# EAGLE design DualLEDPanel v1 (EAGLE 6.4)
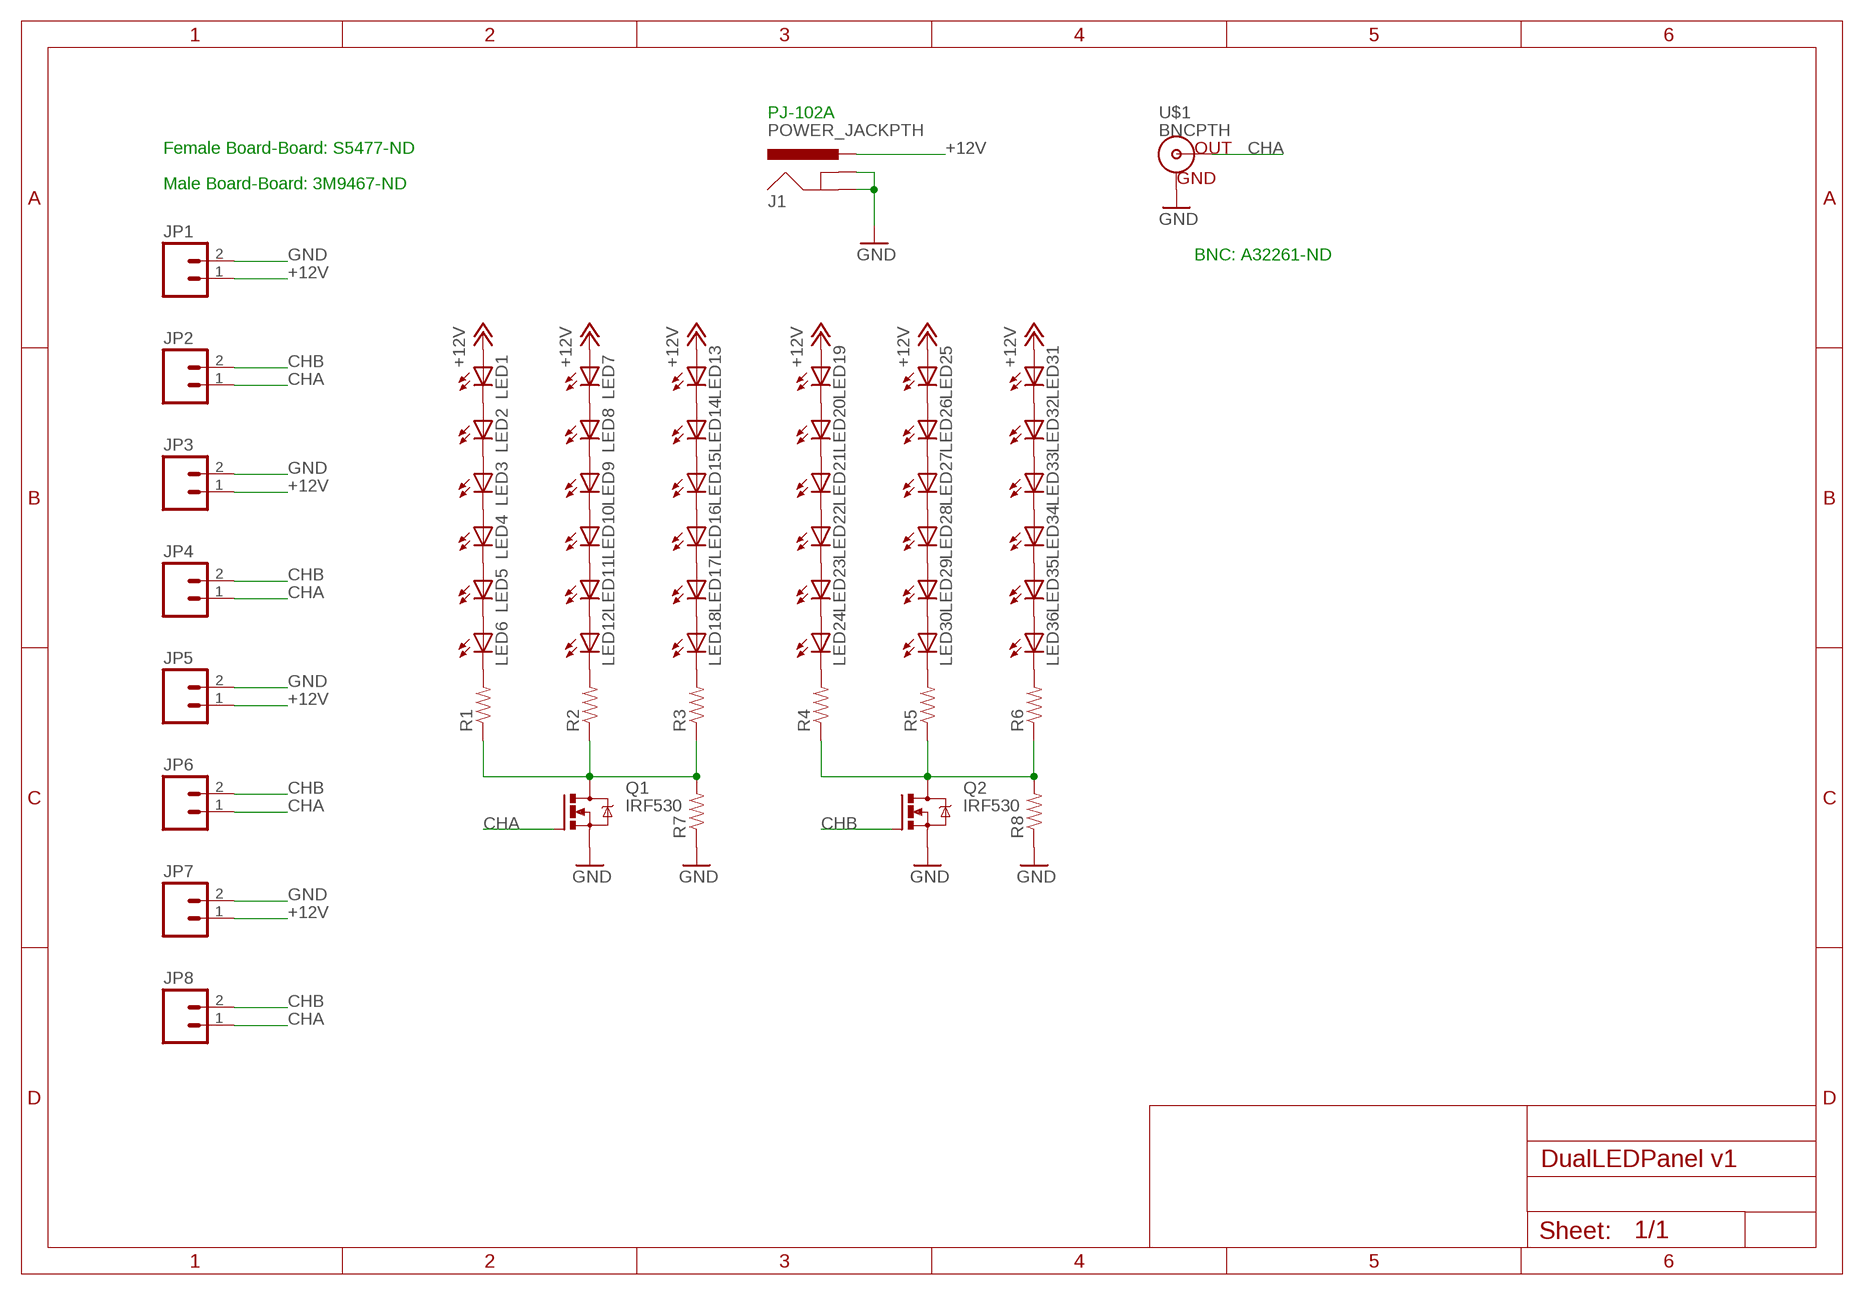
[diagram p0: schematic, sheet 1]

## Parts
J1  POWER_JACKPTH  [POWER_JACK_PTH]
JP1  M02PTH  [1X02]
JP2  M02PTH  [1X02]
JP3  M02PTH  [1X02]
JP4  M02PTH  [1X02]
JP5  M02PTH  [1X02]
JP6  M02PTH  [1X02]
JP7  M02PTH  [1X02]
JP8  M02PTH  [1X02]
LED1  LED5MM  [LED5MM]
LED2  LED5MM  [LED5MM]
LED3  LED5MM  [LED5MM]
LED4  LED5MM  [LED5MM]
LED5  LED5MM  [LED5MM]
LED6  LED5MM  [LED5MM]
LED7  LED5MM  [LED5MM]
LED8  LED5MM  [LED5MM]
LED9  LED5MM  [LED5MM]
LED10  LED5MM  [LED5MM]
LED11  LED5MM  [LED5MM]
LED12  LED5MM  [LED5MM]
LED13  LED5MM  [LED5MM]
LED14  LED5MM  [LED5MM]
LED15  LED5MM  [LED5MM]
LED16  LED5MM  [LED5MM]
LED17  LED5MM  [LED5MM]
LED18  LED5MM  [LED5MM]
LED19  LED5MM  [LED5MM]
LED20  LED5MM  [LED5MM]
LED21  LED5MM  [LED5MM]
LED22  LED5MM  [LED5MM]
LED23  LED5MM  [LED5MM]
LED24  LED5MM  [LED5MM]
LED25  LED5MM  [LED5MM]
LED26  LED5MM  [LED5MM]
LED27  LED5MM  [LED5MM]
LED28  LED5MM  [LED5MM]
LED29  LED5MM  [LED5MM]
LED30  LED5MM  [LED5MM]
LED31  LED5MM  [LED5MM]
LED32  LED5MM  [LED5MM]
LED33  LED5MM  [LED5MM]
LED34  LED5MM  [LED5MM]
LED35  LED5MM  [LED5MM]
LED36  LED5MM  [LED5MM]
Q1  IRF530  [TO220BV]
Q2  IRF530  [TO220BV]
R1  RESISTORPTH-1/4W  [AXIAL-0.4]
R2  RESISTORPTH-1/4W  [AXIAL-0.4]
R3  RESISTORPTH-1/4W  [AXIAL-0.4]
R4  RESISTORPTH-1/4W  [AXIAL-0.4]
R5  RESISTORPTH-1/4W  [AXIAL-0.4]
R6  RESISTORPTH-1/4W  [AXIAL-0.4]
R7  RESISTORPTH-1/4W  [AXIAL-0.4]
R8  RESISTORPTH-1/4W  [AXIAL-0.4]
U$1  BNCPTH  [BNC]

## Nets
+12V: J1.PWR JP1.1 JP3.1 JP5.1 JP7.1 LED1.A LED7.A LED13.A LED19.A LED25.A LED31.A
CHA: JP2.1 JP4.1 JP6.1 JP8.1 Q1.G U$1.S(OUT)
CHB: JP2.2 JP4.2 JP6.2 JP8.2 Q2.G
GND: J1.GND J1.GNDBREAK JP1.2 JP3.2 JP5.2 JP7.2 Q1.S Q2.S R7.P$1 R8.P$1 U$1.GND
N$1: LED1.K(C) LED2.A
N$2: LED2.K(C) LED3.A
N$3: LED3.K(C) LED4.A
N$4: LED4.K(C) LED5.A
N$5: LED5.K(C) LED6.A
N$6: LED6.K(C) R1.P$2
N$7: LED7.K(C) LED8.A
N$8: LED8.K(C) LED9.A
N$9: LED9.K(C) LED10.A
N$10: LED10.K(C) LED11.A
N$11: LED11.K(C) LED12.A
N$12: LED12.K(C) R2.P$2
N$13: LED13.K(C) LED14.A
N$14: LED14.K(C) LED15.A
N$15: LED15.K(C) LED16.A
N$16: LED16.K(C) LED17.A
N$17: LED17.K(C) LED18.A
N$18: LED18.K(C) R3.P$2
N$19: LED19.K(C) LED20.A
N$20: LED20.K(C) LED21.A
N$21: Q1.D R1.P$1 R2.P$1 R3.P$1 R7.P$2
N$22: LED21.K(C) LED22.A
N$23: LED22.K(C) LED23.A
N$24: Q2.D R4.P$1 R5.P$1 R6.P$1 R8.P$2
N$25: LED23.K(C) LED24.A
N$26: LED24.K(C) R4.P$2
N$27: LED25.K(C) LED26.A
N$28: LED26.K(C) LED27.A
N$29: LED27.K(C) LED28.A
N$30: LED28.K(C) LED29.A
N$31: LED29.K(C) LED30.A
N$32: LED30.K(C) R5.P$2
N$33: LED31.K(C) LED32.A
N$34: LED32.K(C) LED33.A
N$35: LED33.K(C) LED34.A
N$36: LED34.K(C) LED35.A
N$37: LED35.K(C) LED36.A
N$38: LED36.K(C) R6.P$2

## Notes on the sheet
- PJ-102A
- Female Board-Board: S5477-ND
- Male Board-Board: 3M9467-ND
- BNC: A32261-ND

## Library data of the parts
J1 = SparkFun-Connectors:POWER_JACK: Power Jack This is the standard 5.5mm barrel jack for power. The PTH is the most common, proven, reliable, footprint. The Slot footprint only works if the mill layer is transmitted to the PCB fab house so be warned. Spark Fun Electronics SKU : PRT-00119 SMT: CONN-08106 Mating wall wart : TOL-00298 (and others)
JP1-JP8 = sparkFun:M02: Header 2 Standard 2-pin 0.1" header. Use with straight break away headers (SKU : PRT-00116), right angle break away headers (PRT-00553), swiss pins (PRT-00743), machine pins (PRT-00117), and female headers (PRT-00115). Molex polarized connector foot print use with SKU : PRT-08233 with associated crimp pins and housings.
LED1-LED36 = SparkFun-LED:LED: LEDs Standard schematic elements and footprints for 5mm, 3mm, 1206, and 0603 sized LEDs. 5mm - Spark Fun Electronics SKU : COM-00529 (and others)
Q1 Q2 = transistor-power:IRF530: HEXFET Power MOSFET
R1-R8 = SparkFun-Passives:RESISTOR: Resistor Basic schematic elements and footprints for 0603, 1206, and PTH resistors.
U$1 = SparkFun-Connectors:BNC: BNC Connector, Mouser Part# 5227161

## Net classes
0 default: width 1.27 mm, clearance 0.508 mm

## Board
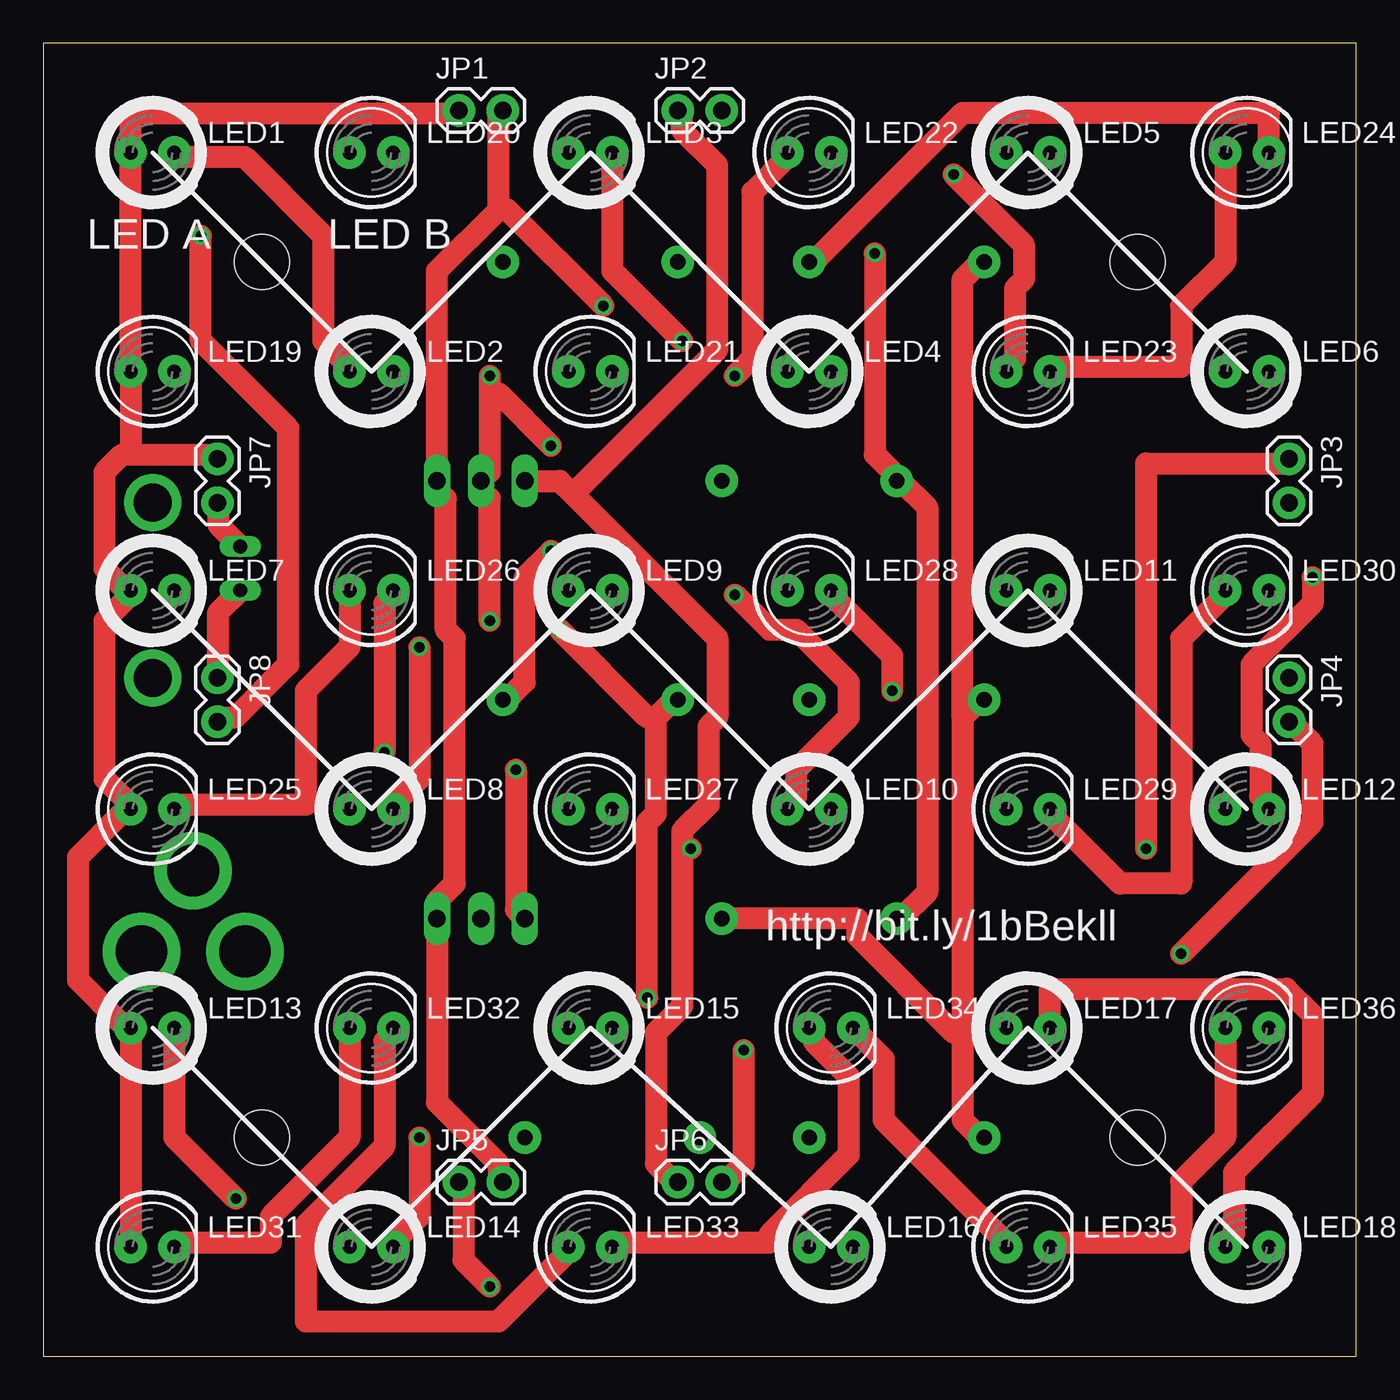
[diagram p1: board, top side]
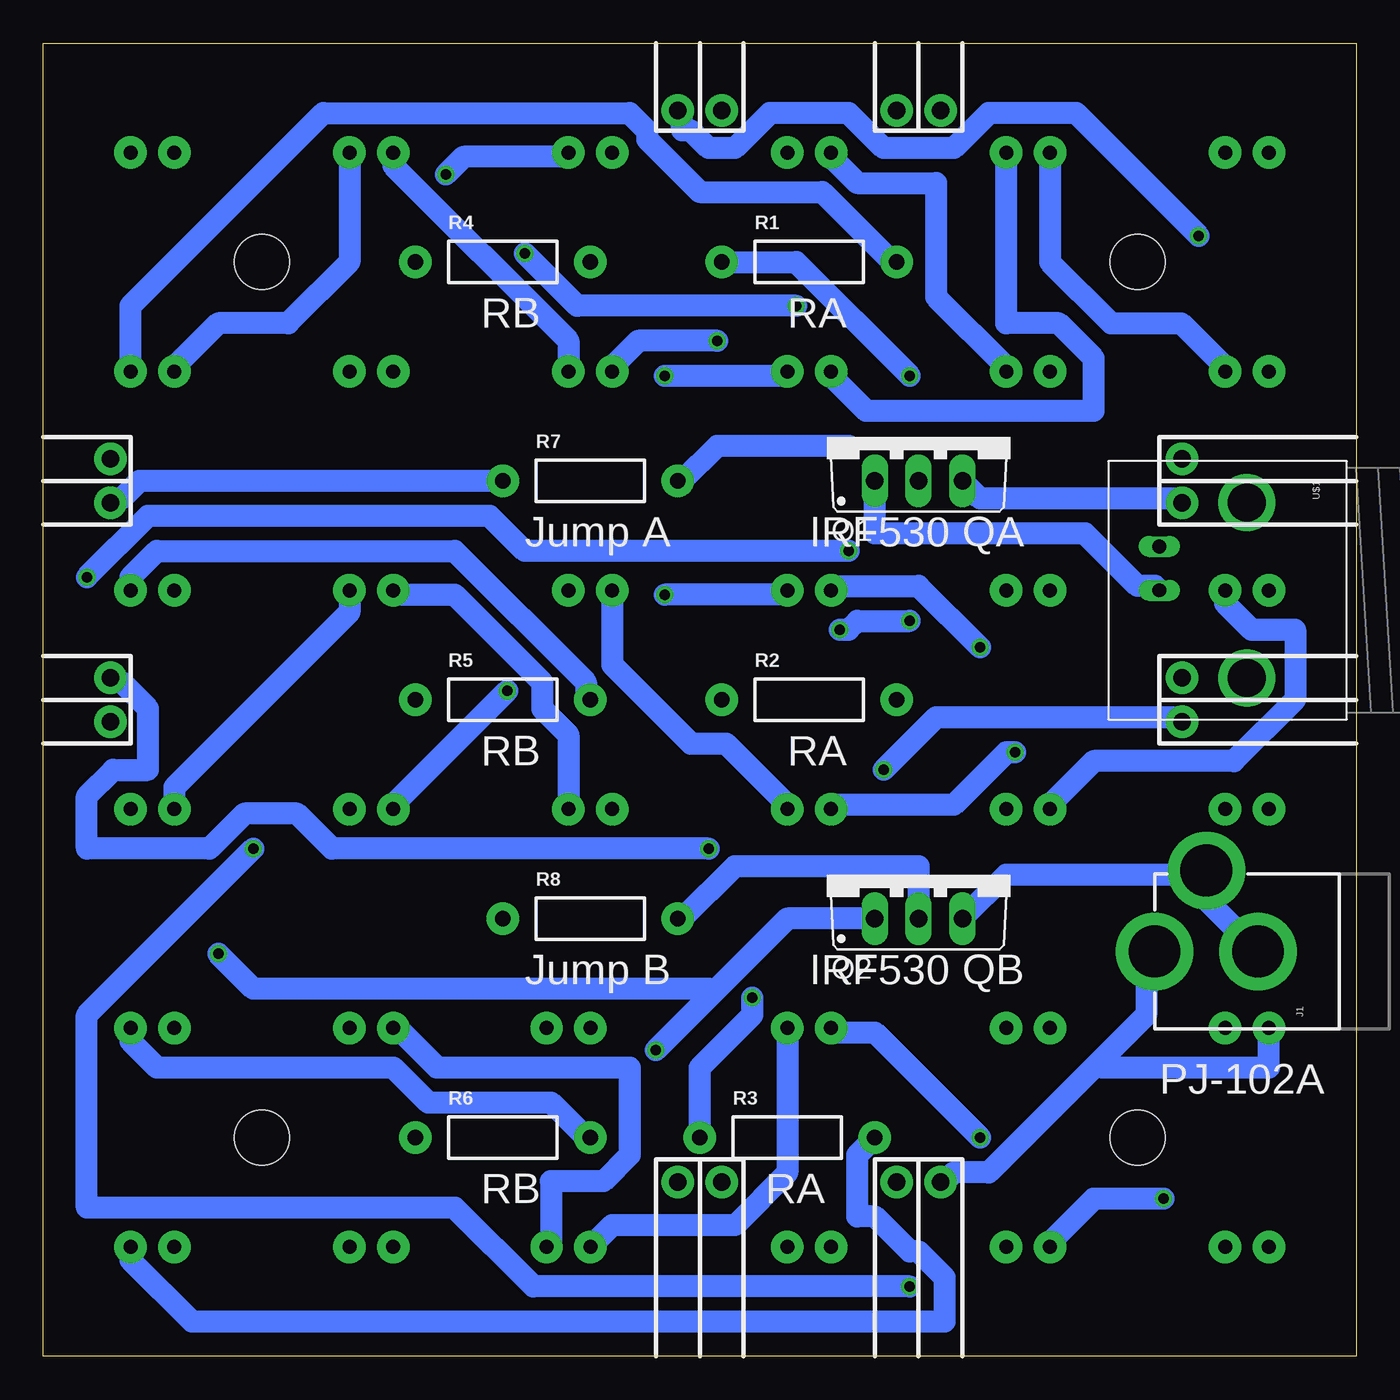
[diagram p2: board, bottom side, seen from below]

Size 76.2 x 76.2 mm. Coordinates in mm from the lower left corner, seen from the top.
Outline: 0,0 76.2,0 76.2,76.2 0,76.2 0,0
Copper layers (1*16): Top 0.0178mm / dielectric 59mil / Bottom 0.0178mm
Design rules "SSC-EAGLE-2Lyr_v1.0.0.3": minimum track width 6mil, minimum drill 14mil, track to track 6mil, track to pad 6mil, pad to pad 6mil, via to via 6mil, smd to smd 6mil, copper to edge 20mil, drill to drill 16mil, minimum pad ring 8mil, minimum via ring 8mil, stop-mask expansion 3mil, vias tented up to drill 0mil, thermal gap 10mil
Holes 3.17 mm at 12.7,12.7 12.7,63.5 63.5,63.5 63.5,12.7

### Footprints (pad centres in the part's own frame; a part is rotated, then mirrored left to right if it is on the bottom)
POWER_JACK_PTH = drill 2.997 pad 4.318: GND 0,7.7; GNDBREAK 4.7,10.7; PWR 0,13.7
1X02 = drill 1.016 pad 1.88: 1 0,0; 2 2.54,0
LED5MM = drill 0.813 pad 1.88: A -1.27,0; K 1.27,0
TO220BV = drill 1.016 long: D 0,-2.54; G -2.54,-2.54; S 2.54,-2.54
AXIAL-0.4 = drill 0.9 pad 1.88: P$1 -5.08,0; P$2 5.08,0
BNC = drill 2.2: 3 -5.08,5.08; 4 5.08,5.08 | drill 0.8 long: GND -2.54,0; S 0,0

### Placement (x,y rotation side)
J1  -1.99,23.5 90 bottom
JP1  24.13,72.29 0 top
JP2  36.83,72.29 0 top
JP3  72.29,52.07 270 top
JP4  72.29,39.37 270 top
JP5  24.13,10.11 0 top
JP6  36.83,10.11 0 top
JP7  10.11,52.07 270 top
JP8  10.11,39.37 270 top
LED1  6.35,69.85 0 top
LED2  19.05,57.15 0 top
LED3  31.75,69.85 0 top
LED4  44.45,57.15 0 top
LED5  57.15,69.85 0 top
LED6  69.85,57.15 0 top
LED7  6.35,44.45 0 top
LED8  19.05,31.75 0 top
LED9  31.75,44.45 0 top
LED10  44.45,31.75 0 top
LED11  57.15,44.45 0 top
LED12  69.85,31.75 0 top
LED13  6.35,19.05 0 top
LED14  19.05,6.35 0 top
LED15  31.75,19.05 0 top
LED16  45.72,6.35 0 top
LED17  57.15,19.05 0 top
LED18  69.85,6.35 0 top
LED19  6.35,57.15 0 top
LED20  19.05,69.85 0 top
LED21  31.75,57.15 0 top
LED22  44.45,69.85 0 top
LED23  57.15,57.15 0 top
LED24  69.85,69.85 0 top
LED25  6.35,31.75 0 top
LED26  19.05,44.45 0 top
LED27  31.75,31.75 0 top
LED28  44.45,44.45 0 top
LED29  57.15,31.75 0 top
LED30  69.85,44.45 0 top
LED31  6.35,6.35 0 top
LED32  19.05,19.05 0 top
LED33  31.75,6.35 0 top
LED34  45.72,19.05 0 top
LED35  57.15,6.35 0 top
LED36  69.85,19.05 0 top
Q1  25.4,53.34 0 bottom
Q2  25.4,27.94 0 bottom
R1  31.75,63.5 0 bottom
R2  31.75,38.1 0 bottom
R3  33.02,12.7 0 bottom
R4  49.53,63.5 0 bottom
R5  49.53,38.1 0 bottom
R6  49.53,12.7 0 bottom
R7  44.45,50.8 0 bottom
R8  44.45,25.4 0 bottom
U$1  11.43,44.45 270 bottom

### Tracks (layer width: path | path; a pad name or v marks a point on that pad's centre or on a via)
+12V  (via drill 0.61)
  Top 1.27: 5.08,52.32 9.65,52.32 JP7.1 | 5.08,52.32 LED19.A LED1.A 5.08,72.14 23.88,72.14 JP1.1 | 5.08,52.32 4.57,52.32 3.56,51.31 3.56,45.72 4.57,44.7 LED7.A 5.08,44.2 3.56,42.67 3.56,33.53 5.08,32 LED25.A 4.57,31.5 2.03,28.96 2.03,21.84 4.57,19.3 LED13.A LED31.A | v64.01,29.46 64.01,51.82 72.14,51.82 JP3.1 | v25.91,4.06 24.38,5.59 24.38,9.65 JP5.1
  Bottom 1.27: 14.99,17.02 12.19,19.81 12.19,23.37 J1.PWR | 14.99,17.02 21.34,10.67 23.37,10.67 23.88,10.16 JP5.1 | v64.01,29.46 73.66,19.81 73.66,8.64 52.32,8.64 47.75,4.06 v25.91,4.06 | LED13.A 5.08,16.76 14.73,16.76 14.99,17.02
CHA  (via drill 0.61)
  Top 1.27: U$1.S 10.16,43.18 10.16,39.62 JP8.1 | 37.08,29.46 37.08,30.48 38.61,32 38.61,36.58 39.12,37.08 39.12,41.66 30.73,50.04 | 37.08,29.46 37.08,20.32 35.56,18.8 35.56,11.18 36.58,10.16 JP6.1 | 30.73,50.04 29.97,50.8 Q1.G | v37.59,29.46 37.08,29.46 | 30.73,50.04 39.12,58.42 39.12,69.09 37.08,71.12 37.08,72.14 JP2.1
  Bottom 1.27: Q1.G 27.94,47.75 15.75,47.75 12.7,44.7 11.68,44.7 U$1.S | v37.59,29.46 59.44,29.46 61.47,31.5 64.52,31.5 66.55,29.46 73.66,29.46 73.66,32.51 72.14,34.04 70.1,34.04 70.1,37.59 71.63,39.12 72.14,39.12 JP4.1
CHB  (via drill 0.61)
  Top 1.27: Q2.G 27.43,25.91 v27.43,34.04 | v40.64,17.78 40.64,11.18 39.62,10.16 JP6.2 | v9.14,65.02 9.14,58.93 14.22,53.85 14.22,40.13 11.18,37.08 10.16,37.08 JP8.2 | v66.04,23.37 73.66,30.99 73.66,35.56 72.64,36.58 JP4.2
  Bottom 1.27: v27.43,34.04 24.38,37.08 10.16,37.08 JP8.2 | 37.34,21.08 33.02,25.4 Q2.G | 37.34,21.08 v40.64,17.78 | v9.14,65.02 16.26,72.14 21.34,72.14 23.37,70.1 27.43,70.1 29.46,72.14 34.04,72.14 36.07,70.1 37.59,70.1 38.61,71.12 39.12,71.12 39.12,72.14 JP2.2 | v66.04,23.37 64.01,21.34 37.59,21.34 37.34,21.08
GND  (via drill 0.61)
  Top 1.27: R8.P$1 49.78,25.4 51.31,26.92 51.31,49.28 49.78,50.8 R7.P$1 49.28,51.31 48.26,52.32 v48.26,64.01 | U$1.GND 10.16,48.26 10.16,49.28 JP7.2 | 26.42,66.55 26.42,72.14 JP1.2 | 26.42,66.55 22.86,62.99 Q1.S 22.86,50.29 23.37,49.78 23.37,42.16 23.88,41.66 23.88,27.43 22.86,26.42 Q2.S 22.86,14.73 26.42,11.18 26.42,10.16 JP5.2 | v32.51,60.96 26.92,66.55 26.42,66.55
  Bottom 1.27: R7.P$1 70.61,50.8 71.63,49.78 72.14,49.78 JP3.2 | Q1.S 21.84,49.78 10.16,49.78 JP7.2 | Q2.S 20.32,27.94 9.14,27.94 J1.GNDBREAK 9.65,27.43 6.1,23.88 J1.GND | v48.26,64.01 45.21,60.96 v32.51,60.96
N$1
  Top 1.27: LED2.A 17.78,57.4 16.26,58.93 16.26,65.02 11.68,69.6 7.62,69.6 LED1.K
N$2
  Bottom 1.27: LED2.K 20.32,57.4 24.38,61.47 24.38,68.07 28.96,68.07 30.48,69.6 LED3.A
N$3  (via drill 0.61)
  Top 1.27: v37.08,58.93 33.02,62.99 LED3.K
  Bottom 1.27: v37.08,58.93 41.66,58.93 43.18,57.4 LED4.A
N$4
  Bottom 1.27: LED4.K 45.72,58.93 55.88,69.09 LED5.A
N$5
  Bottom 1.27: LED5.K 58.42,63.5 61.98,59.94 66.04,59.94 68.58,57.4 LED6.A
N$6
  Bottom 1.27: LED6.K 71.12,60.96 59.94,72.14 42.16,72.14 41.15,71.12 41.15,70.61 38.1,67.56 30.99,67.56 26.92,63.5 R1.P$2
N$7
  Bottom 1.27: LED7.K 7.62,43.69 6.1,42.16 3.56,42.16 3.56,38.1 7.11,34.54 15.24,34.54 17.78,32 LED8.A
N$8  (via drill 0.61)
  Top 1.27: v21.84,41.15 21.84,33.53 20.32,32 LED8.K
  Bottom 1.27: v21.84,41.15 25.4,44.7 30.48,44.7 LED9.A
N$9  (via drill 0.61)
  Top 1.27: v40.13,44.2 42.16,42.16 43.69,42.16 46.74,39.12 46.74,37.08 43.69,34.04 43.69,32.51 43.18,32 LED10.A
  Bottom 1.27: v40.13,44.2 33.02,44.2 LED9.K
N$10
  Bottom 1.27: LED10.K 45.72,36.07 47.24,37.59 47.24,39.12 52.32,44.2 55.88,44.2 LED11.A
N$11
  Bottom 1.27: LED12.A 68.58,33.02 58.42,43.18 LED11.K
N$12  (via drill 0.61)
  Top 1.27: v73.66,45.21 73.66,43.69 70.1,40.13 70.1,36.07 70.61,35.56 70.61,32.51 71.12,32 LED12.K | v29.46,46.74 27.94,45.21 27.94,39.12 26.92,38.1 R2.P$2
  Bottom 1.27: v73.66,45.21 70.1,48.77 50.29,48.77 48.26,46.74 v29.46,46.74
N$13  (via drill 0.61)
  Top 1.27: v11.18,9.14 7.62,12.7 LED13.K
  Bottom 1.27: v11.18,9.14 15.24,9.14 17.78,6.6 LED14.A
N$14  (via drill 0.61)
  Top 1.27: v21.84,12.7 21.84,8.13 20.32,6.6 LED14.K
  Bottom 1.27: v21.84,12.7 27.94,18.8 30.48,18.8 LED15.A
N$15
  Bottom 1.27: LED16.A 43.18,7.62 36.07,7.62 33.02,10.67 LED15.K
N$16
  Bottom 1.27: LED16.K 46.74,6.6 46.74,10.16 43.69,10.16 42.16,11.68 42.16,16.76 53.34,16.76 55.37,18.8 55.88,18.8 LED17.A
N$17
  Top 1.27: LED17.K 58.42,21.34 72.14,21.34 73.66,19.81 73.66,15.24 69.09,10.67 69.09,7.11 68.58,6.6 LED18.A
N$18
  Bottom 1.27: R3.P$2 28.96,11.68 28.96,8.13 27.94,8.13 25.91,6.1 25.4,6.1 23.88,4.57 23.88,2.03 67.56,2.03 71.12,5.59 LED18.K
N$19
  Bottom 1.27: LED20.A 17.78,63.5 14.22,59.94 10.16,59.94 7.62,57.4 LED19.K
N$20
  Bottom 1.27: LED20.K 20.32,59.94 17.27,59.94 15.24,57.91 15.24,54.86 28.45,54.86 30.48,56.9 LED21.A
N$21  (via drill 0.61)
  Top 1.27: v25.91,56.9 25.91,55.88 | 25.91,55.88 25.91,51.31 Q1.D 25.4,50.29 25.91,49.78 v25.91,42.67 | v29.46,52.83 26.42,55.88 25.91,55.88 | 35.56,37.08 36.58,38.1 R2.P$1 | 35.56,37.08 35.56,31.5 35.05,30.99 v35.05,20.83 | v29.97,42.16 35.05,37.08 35.56,37.08
  Bottom 1.27: v25.91,56.9 32.51,63.5 R1.P$1 | v29.46,52.83 37.08,52.83 39.12,50.8 R7.P$2 | v35.05,20.83 35.05,19.81 38.1,16.76 R3.P$1 | v25.91,42.67 28.96,42.67 29.46,42.16 v29.97,42.16
N$22  (via drill 0.61)
  Top 1.27: v40.13,56.9 41.15,57.91 41.15,67.56 43.18,69.6 LED22.A
  Bottom 1.27: v40.13,56.9 33.02,56.9 LED21.K
N$23  (via drill 0.61)
  Top 1.27: v52.83,68.58 56.9,64.52 56.9,62.48 56.39,61.98 56.39,57.91 55.88,57.4 LED23.A
  Bottom 1.27: v52.83,68.58 51.82,69.6 45.72,69.6 LED22.K
N$24
  Top 1.27: 53.34,37.08 53.34,18.8 | 53.34,18.8 53.34,13.72 54.36,12.7 R6.P$1 | 53.34,37.08 54.36,38.1 R5.P$1 | 53.34,37.08 53.34,62.48 54.36,63.5 R4.P$1 | R8.P$2 47.24,25.4 47.24,24.38 52.83,18.8 53.34,18.8
  Bottom 1.27: Q2.D 25.4,28.45 36.07,28.45 39.12,25.4 R8.P$2
N$25
  Top 1.27: LED24.A 68.58,63.5 66.04,60.96 66.04,57.4 58.42,57.4 LED23.K
N$26
  Top 1.27: LED24.K 71.12,72.14 53.34,72.14 44.7,63.5 R4.P$2
N$27
  Top 1.27: LED26.A 17.78,41.15 15.24,38.61 15.24,32 7.62,32 LED25.K
N$28  (via drill 0.61)
  Top 1.27: v19.81,35.05 19.81,43.69 20.32,44.2 LED26.K
  Bottom 1.27: v19.81,35.05 20.32,35.05 23.37,32 30.48,32 LED27.A
N$29
  Bottom 1.27: LED28.A 43.18,40.13 38.61,35.56 36.58,35.56 33.02,32 LED27.K
N$30  (via drill 0.61)
  Top 1.27: v49.28,38.61 49.28,40.64 45.72,44.2 LED28.K
  Bottom 1.27: v49.28,38.61 55.88,32 LED29.A
N$31
  Top 1.27: LED29.K 58.42,31.5 62.48,27.43 66.04,27.43 66.04,41.66 68.58,44.2 LED30.A
N$32
  Bottom 1.27: LED30.K 71.12,45.21 69.6,46.74 52.32,46.74 44.7,39.12 44.7,38.1 R5.P$2
N$33
  Top 1.27: LED32.A 17.78,12.7 13.21,8.13 13.21,6.6 7.62,6.6 LED31.K
N$34
  Top 1.27: LED33.A 30.48,6.1 26.42,2.03 15.24,2.03 15.24,7.62 19.81,12.19 19.81,18.29 20.32,18.8 LED32.K
N$35
  Top 1.27: LED33.K 33.02,6.6 42.16,6.6 42.16,7.11 46.74,11.68 46.74,16.26 44.7,18.29 44.7,18.8 LED34.A
N$36
  Top 1.27: LED34.K 48.77,17.27 48.77,13.72 55.88,6.6 LED35.A
N$37
  Top 1.27: LED36.A 68.58,12.7 66.04,10.16 66.04,6.6 58.42,6.6 LED35.K
N$38
  Bottom 1.27: LED36.K 71.12,18.29 69.6,16.76 55.88,16.76 53.85,14.73 46.74,14.73 44.7,12.7 R6.P$2

### Text on the board
tPlace: LED A | LED B | http://bit.ly/1bBekll
bPlace: RA | RB | IRF530 QA | Jump A | RA | RB | IRF530 QB | Jump B | PJ-102A | RA | RB